# EAGLE design pikado (EAGLE 5.07)
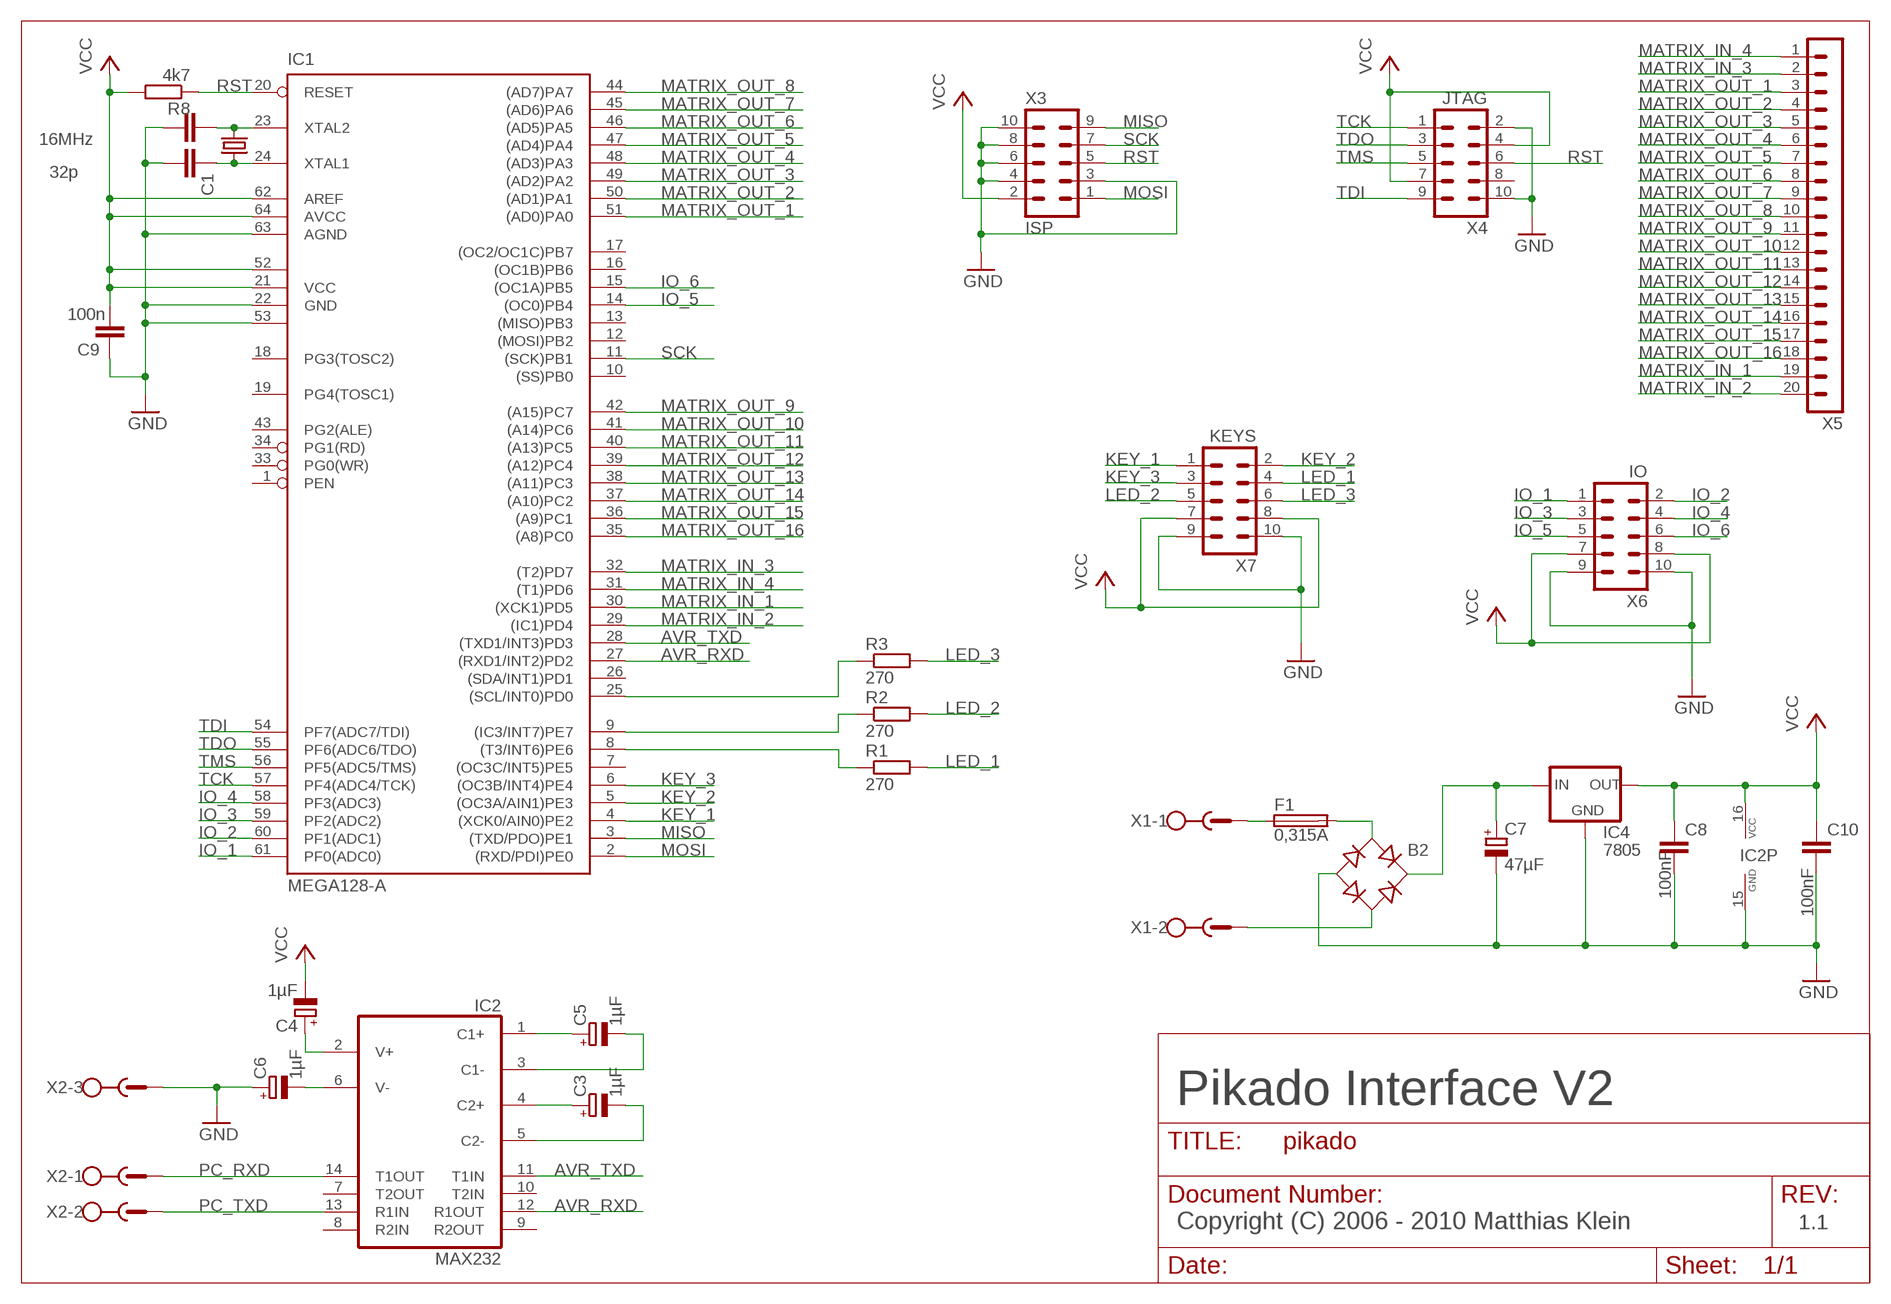
[diagram p0: schematic, sheet 1]

## Parts
B2  RB1A  [RB1A]
C1  32p  C-EU025-025X050  [C025-025X050]
C2  32p  C-EU025-025X050  [C025-025X050]
C3  1µF  CPOL-EUE2.5-5  [E2,5-5]
C4  1µF  CPOL-EUE2.5-5  [E2,5-5]
C5  1µF  CPOL-EUE2.5-5  [E2,5-5]
C6  1µF  CPOL-EUE2.5-5  [E2,5-5]
C7  47µF  CPOL-EUE2-5  [E2-5]
C8  100nF  C-EU025-025X050  [C025-025X050]
C9  100n  C-EU025-025X050  [C025-025X050]
C10  100nF  C-EU025-025X050  [C025-025X050]
F1  0,315A  TR5  [TR5]
IC1  MEGA128-A  [TQFP64]
IC2  MAX232  [DIL16]
IC4  7805  78XXS  [78XXS]
Q1  16MHz  CRYSTALHC49U-V  [HC49U-V]
R1  270  R-EU_0207/10  [0207/10]
R2  270  R-EU_0207/10  [0207/10]
R3  270  R-EU_0207/10  [0207/10]
R8  4k7  R-EU_0207/10  [0207/10]
X1  RIA182-02  [RIA182-02]
X2  RIA182-03  [RIA182-03]
X3  ISP  ML10  [ML10]
X4  JTAG  ML10  [ML10]
X5  MA20-1  [MA20-1]
X6  IO  ML10  [ML10]
X7  KEYS  ML10  [ML10]

## Nets
AVR_RXD: IC1.27((RXD1/INT2)PD2) IC2.12(R1OUT)
AVR_TXD: IC1.28((TXD1/INT3)PD3) IC2.11(T1IN)
GND: B2.- C1.2 C2.2 C6.+ C7.- C8.2 C9.1 C10.2 IC1.22(GND) IC1.53(GND1) IC1.63(AGND) IC2.15(GND) IC4.GND X2.3 X3.3 X3.4 X3.6 X3.8 X3.10 X4.2 X4.10 X6.9 X6.10 X7.9 X7.10
IO_1: IC1.61(PF0(ADC0)) X6.1
IO_2: IC1.60(PF1(ADC1)) X6.2
IO_3: IC1.59(PF2(ADC2)) X6.3
IO_4: IC1.58(PF3(ADC3)) X6.4
IO_5: IC1.14((OC0)PB4) X6.5
IO_6: IC1.15((OC1A)PB5) X6.6
KEY_1: IC1.4((XCK0/AIN0)PE2) X7.1
KEY_2: IC1.5((OC3A/AIN1)PE3) X7.2
KEY_3: IC1.6((OC3B/INT4)PE4) X7.3
LED_1: R1.2 X7.4
LED_2: R2.2 X7.5
LED_3: R3.2 X7.6
MATRIX_IN_1: IC1.30((XCK1)PD5) X5.19
MATRIX_IN_2: IC1.29((IC1)PD4) X5.20
MATRIX_IN_3: IC1.32((T2)PD7) X5.2
MATRIX_IN_4: IC1.31((T1)PD6) X5.1
MATRIX_OUT_1: IC1.51((AD0)PA0) X5.3
MATRIX_OUT_2: IC1.50((AD1)PA1) X5.4
MATRIX_OUT_3: IC1.49((AD2)PA2) X5.5
MATRIX_OUT_4: IC1.48((AD3)PA3) X5.6
MATRIX_OUT_5: IC1.47((AD4)PA4) X5.7
MATRIX_OUT_6: IC1.46((AD5)PA5) X5.8
MATRIX_OUT_7: IC1.45((AD6)PA6) X5.9
MATRIX_OUT_8: IC1.44((AD7)PA7) X5.10
MATRIX_OUT_9: IC1.42((A15)PC7) X5.11
MATRIX_OUT_10: IC1.41((A14)PC6) X5.12
MATRIX_OUT_11: IC1.40((A13)PC5) X5.13
MATRIX_OUT_12: IC1.39((A12)PC4) X5.14
MATRIX_OUT_13: IC1.38((A11)PC3) X5.15
MATRIX_OUT_14: IC1.37((A10)PC2) X5.16
MATRIX_OUT_15: IC1.36((A9)PC1) X5.17
MATRIX_OUT_16: IC1.35((A8)PC0) X5.18
MISO: IC1.3((TXD/PDO)PE1) X3.9
MOSI: IC1.2((RXD/PDI)PE0) X3.1
N$1: C6.- IC2.6(V-)
N$2: B2.+ C7.+ IC4.IN
N$3: C1.1 IC1.24(XTAL1) Q1.1
N$4: IC1.8((T3/INT6)PE6) R1.1
N$5: C2.1 IC1.23(XTAL2) Q1.2
N$7: F1.1 X1.1
N$8: C5.+ IC2.1(C1+)
N$9: C3.+ IC2.4(C2+)
N$10: C5.- IC2.3(C1-)
N$11: C3.- IC2.5(C2-)
N$12: C4.+ IC2.2(V+)
N$13: B2.AC1 F1.2
N$14: IC1.9((IC3/INT7)PE7) R2.1
N$15: IC1.25((SCL/INT0)PD0) R3.1
N$16: B2.AC2 X1.2
PC_RXD: IC2.14(T1OUT) X2.1
PC_TXD: IC2.13(R1IN) X2.2
RST: IC1.20(RESET) R8.1 X3.5 X4.6
SCK: IC1.11((SCK)PB1) X3.7
TCK: IC1.57(PF4(ADC4/TCK)) X4.1
TDI: IC1.54(PF7(ADC7/TDI)) X4.9
TDO: IC1.55(PF6(ADC6/TDO)) X4.3
TMS: IC1.56(PF5(ADC5/TMS)) X4.5
VCC: C4.- C8.1 C9.2 C10.1 IC1.21(VCC) IC1.52(VCC1) IC1.62(AREF) IC1.64(AVCC) IC2.16(VCC) IC4.OUT R8.2 X3.2 X4.4 X4.7 X6.7 X6.8 X7.7 X7.8
Unconnected: IC1.1(PEN) IC1.7((OC3C/INT5)PE5) IC1.10((SS)PB0) IC1.12((MOSI)PB2) IC1.13((MISO)PB3) IC1.16((OC1B)PB6) IC1.17((OC2/OC1C)PB7) IC1.18(PG3(TOSC2)) IC1.19(PG4(TOSC1)) IC1.26((SDA/INT1)PD1) IC1.33(PG0(WR)) IC1.34(PG1(RD)) IC1.43(PG2(ALE)) IC2.7(T2OUT) IC2.8(R2IN) IC2.9(R2OUT) IC2.10(T2IN) X4.8

## Notes on the sheet
- Pikado Interface V2
- Copyright (C) 2006 - 2010 Matthias Klein | 1.1

## Library data of the parts
B2 = rectifier:RB1A: RECTIFIER 1 A
C1 C2 C8-C10 = rcl:C-EU: CAPACITOR, European symbol
C3-C7 = rcl:CPOL-EU: POLARIZED CAPACITOR, European symbol
F1 = fuse:TR5: FUSE Wickmann
IC1 = atmel:MEGA128: MICROCONTROLLER 128 Kbytes FLASH 4 Kbytes SRAM 4 Kbytes EEPROM DUAL USART 8-channel 10 bit ADC Source: avr.lbr
IC2 = maxim:MAX232: RS232 TRANSEIVER
IC4 = v-reg:78XXS: VOLTAGE REGULATOR
Q1 = crystal:CRYSTAL: CRYSTAL
R1-R3 R8 = rcl:R-EU_: RESISTOR, European symbol
X1 = con-ria182:RIA182-02: Gewinkelter Wannenstecker 2-polig Rastermaß: 3,5mm Lötstift / Steckerstift: 1x1mm Bohrung: 1,5mm Bemessungsstrom: 5A Nennquerschnitt Stecker: 1,5qmm eindrähtig / 1qmm feinstdrähtig
X2 = con-ria182:RIA182-03: Gewinkelter Wannenstecker 3-polig Rastermaß: 3,5mm Lötstift / Steckerstift: 1x1mm Bohrung: 1,5mm Bemessungsstrom: 5A Nennquerschnitt Stecker: 1,5qmm eindrähtig / 1qmm feinstdrähtig
X3 X4 X6 X7 = con-harting-ml:ML10: HARTING
X5 = con-lstb:MA20-1: PIN HEADER

## Board
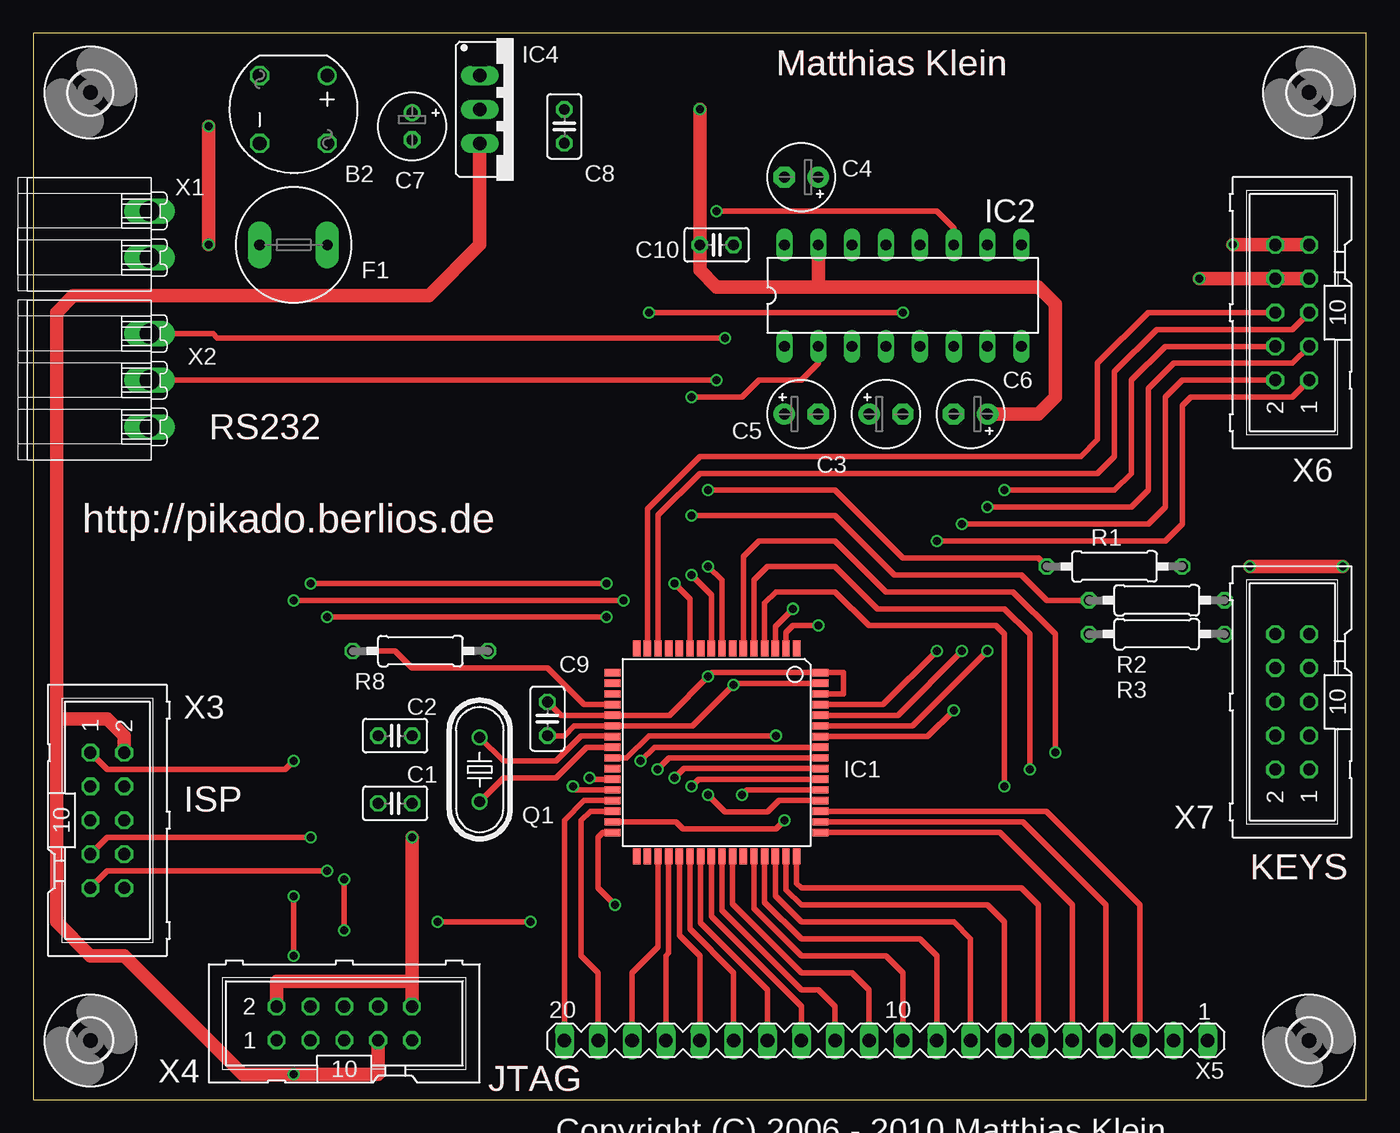
[diagram p1: board, top side]
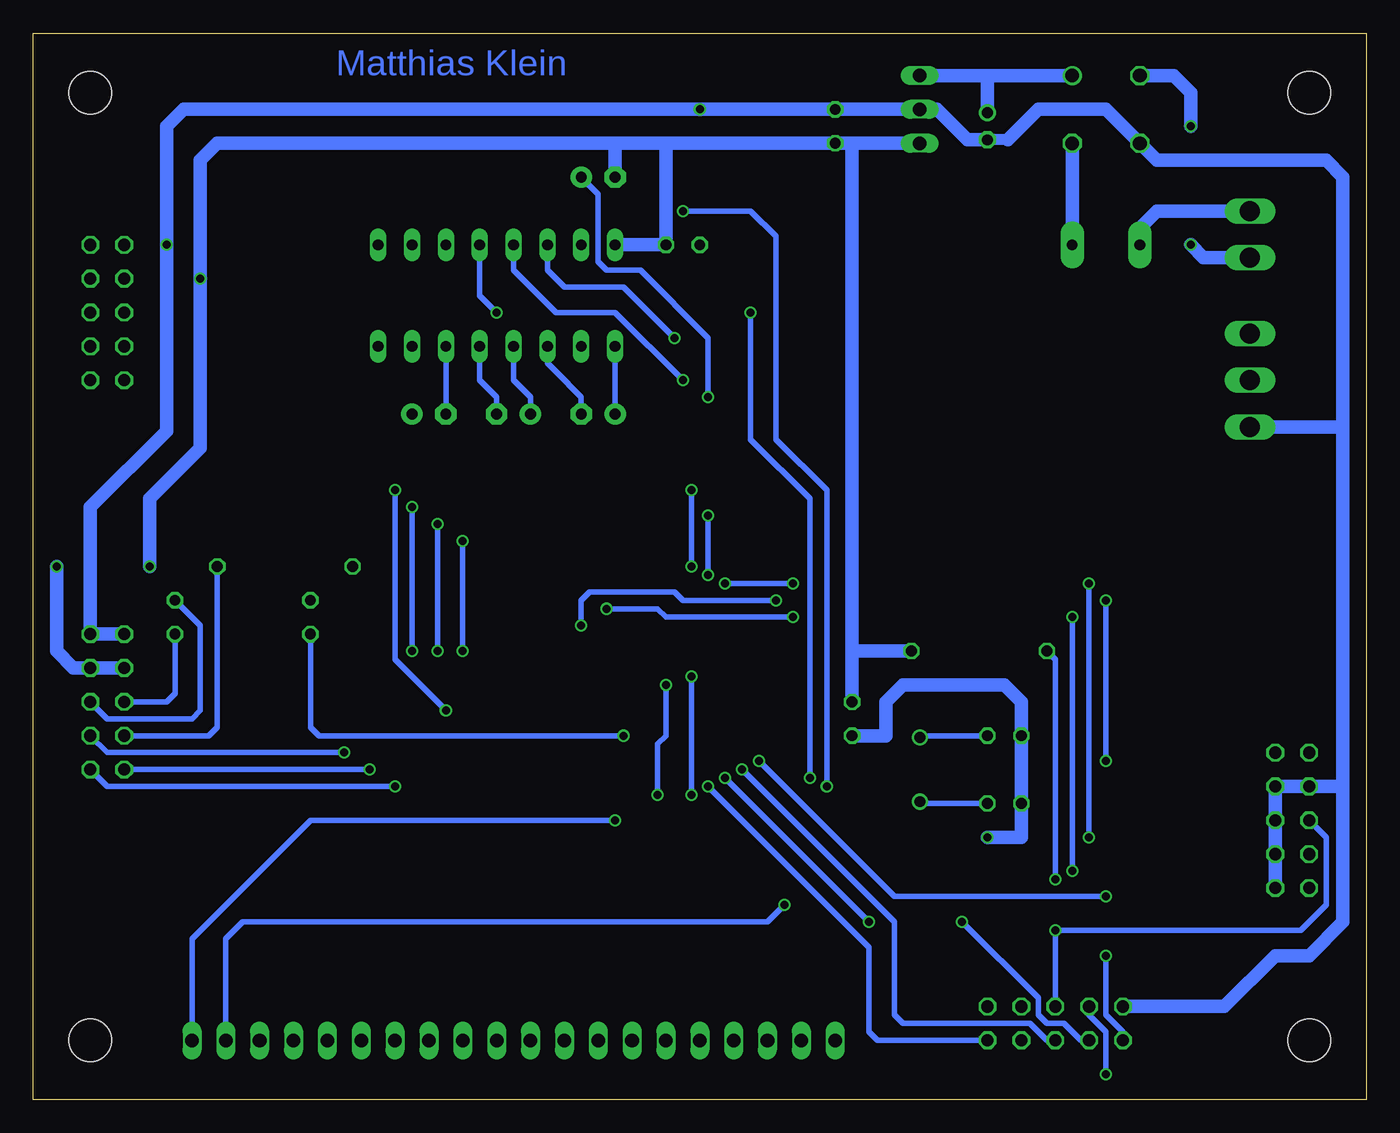
[diagram p2: board, bottom side, seen from below]

Size 100 x 80 mm. Coordinates in mm from the lower left corner, seen from the top.
Outline: 0,0 100,0 100,80 0,80 0,0
Copper layers (1*16): Top 0.035mm / dielectric 1.5mm / Bottom 0.035mm
Design rules "PCB-POOL *": minimum track width 6mil, minimum drill 12mil, track to track 6mil, track to pad 6mil, pad to pad 6mil, via to via 6mil, smd to smd 6mil, copper to edge 20mil, drill to drill 8mil, minimum pad ring 8mil, minimum via ring 6mil, stop-mask expansion 3mil, vias tented up to drill 0mil, thermal gap 8mil

### Footprints (pad centres in the part's own frame; a part is rotated, then mirrored left to right if it is on the bottom)
RB1A = drill 1.016 round: + -2.54,2.54 | drill 1.016 octagon: - 2.54,-2.54; AC1 2.54,2.54; AC2 -2.54,-2.54
C025-025X050 = drill 0.813 octagon: 1 -1.27,0; 2 1.27,0
E2,5-5 = drill 0.813 pad 1.6 round: + -1.27,0 | drill 0.813 pad 1.6 octagon: - 1.27,0
E2-5 = drill 0.813 pad 1.27 round: + -1.016,0 | drill 0.813 pad 1.27 octagon: - 1.016,0
TR5 = drill 0.813 pad 1.778 long: 1 -2.54,0; 2 2.54,0
TQFP64 = smd 1.194 x 0.559: 1 -7.8,6; 2 -7.8,5.2; 3 -7.8,4.4; 4 -7.8,3.6; 5 -7.8,2.8; 6 -7.8,2; 7 -7.8,1.2; 8 -7.8,0.4; 9 -7.8,-0.4; 10 -7.8,-1.2; 11 -7.8,-2; 12 -7.8,-2.8; 13 -7.8,-3.6; 14 -7.8,-4.4; 15 -7.8,-5.2; 16 -7.8,-6; 33 7.8,-6; 34 7.8,-5.2; 35 7.8,-4.4; 36 7.8,-3.6; 37 7.8,-2.8; 38 7.8,-2; 39 7.8,-1.2; 40 7.8,-0.4; 41 7.8,0.4; 42 7.8,1.2; 43 7.8,2; 44 7.8,2.8; 45 7.8,3.6; 46 7.8,4.4; 47 7.8,5.2; 48 7.8,6 | smd 0.559 x 1.194: 17 -6,-7.8; 18 -5.2,-7.8; 19 -4.4,-7.8; 20 -3.6,-7.8; 21 -2.8,-7.8; 22 -2,-7.8; 23 -1.2,-7.8; 24 -0.4,-7.8; 25 0.4,-7.8; 26 1.2,-7.8; 27 2,-7.8; 28 2.8,-7.8; 29 3.6,-7.8; 30 4.4,-7.8; 31 5.2,-7.8; 32 6,-7.8; 49 6,7.8; 50 5.2,7.8; 51 4.4,7.8; 52 3.6,7.8; 53 2.8,7.8; 54 2,7.8; 55 1.2,7.8; 56 0.4,7.8; 57 -0.4,7.8; 58 -1.2,7.8; 59 -2,7.8; 60 -2.8,7.8; 61 -3.6,7.8; 62 -4.4,7.8; 63 -5.2,7.8; 64 -6,7.8
DIL16 = drill 0.813 long: 1 -8.89,-3.81; 2 -6.35,-3.81; 3 -3.81,-3.81; 4 -1.27,-3.81; 5 1.27,-3.81; 6 3.81,-3.81; 7 6.35,-3.81; 8 8.89,-3.81; 9 8.89,3.81; 10 6.35,3.81; 11 3.81,3.81; 12 1.27,3.81; 13 -1.27,3.81; 14 -3.81,3.81; 15 -6.35,3.81; 16 -8.89,3.81
78XXS = drill 1.016 long: GND 0,-2.54; IN -2.54,-2.54; OUT 2.54,-2.54
HC49U-V = drill 0.813 round: 1 -2.413,0; 2 2.413,0
0207/10 = drill 0.813 octagon: 1 -5.08,0; 2 5.08,0
3,2 = hole 3.2: 0,0
RIA182-02 = drill 1.5 long: 1 0,0; 2 3.5,0
RIA182-03 = drill 1.5 long: 1 -3.5,0; 2 0,0; 3 3.5,0
ML10 = drill 0.914 octagon: 1 -5.08,-1.27; 2 -5.08,1.27; 3 -2.54,-1.27; 4 -2.54,1.27; 5 0,-1.27; 6 0,1.27; 7 2.54,-1.27; 8 2.54,1.27; 9 5.08,-1.27; 10 5.08,1.27
MA20-1 = drill 1.016 long: 1 -24.13,0; 2 -21.59,0; 3 -19.05,0; 4 -16.51,0; 5 -13.97,0; 6 -11.43,0; 7 -8.89,0; 8 -6.35,0; 9 -3.81,0; 10 -1.27,0; 11 1.27,0; 12 3.81,0; 13 6.35,0; 14 8.89,0; 15 11.43,0; 16 13.97,0; 17 16.51,0; 18 19.05,0; 19 21.59,0; 20 24.13,0

### Placement (x,y rotation side)
B2  19.52,74.29 270 top
C1  27.14,22.22 180 top
C2  27.14,27.3 180 top
C3  63.97,51.43 0 top
C4  57.62,69.21 180 top
C5  57.62,51.43 0 top
C6  70.32,51.43 180 top
C7  28.41,73.02 270 top
C8  39.84,73.02 90 top
C9  38.57,28.57 90 top
C10  51.27,64.13 180 top
F1  19.52,64.13 0 top
IC1  51.27,26.03 270 top
IC2  65.24,60.32 0 top
IC4  36.03,74.29 270 top
Q1  33.49,24.76 90 top
R1  81.11,40 0 top
R2  84.29,37.46 0 top
R3  84.29,34.92 0 top
R8  29.04,33.65 0 top
U$1  [3,2]  4.28,75.56 0 top
U$2  [3,2]  4.28,4.44 0 top
U$3  [3,2]  95.72,4.44 0 top
U$4  [3,2]  95.72,75.56 0 top
X1  8.73,66.67 270 top
X2  8.73,53.97 270 top
X3  5.55,20.95 270 top
X4  23.33,5.71 0 top
X5  63.97,4.44 180 top
X6  94.45,59.05 90 top
X7  94.45,29.84 90 top

### Tracks (layer width: path | path; a pad name or v marks a point on that pad's centre or on a via)
AVR_RXD  (via drill 0.6)
  Top 0.406: v46.19,59.05 v65.24,59.05 | IC1.27 41.84,24.03 v41.74,24.12
  Bottom 0.406: IC2.12 66.51,60.32 v65.24,59.05 | v41.74,24.12 41.74,45.08 46.19,49.53 v46.19,59.05
AVR_TXD  (via drill 0.6)
  Top 0.406: IC1.28 40.73,23.23 v40.48,23.49 | IC2.11 69.05,65.4 67.78,66.67 v51.27,66.67
  Bottom 0.406: v51.27,66.67 46.19,66.67 44.28,64.77 44.28,49.53 40.48,45.72 v40.48,23.49
GND  (via drill 0.6)
  Top 0.406: C9.1 39.84,27.3 40.57,28.03 IC1.22 49.46,28.03 v52.54,31.11 52.66,31.23 IC1.63 | IC1.53 53.55,23.23 v53.17,22.86
  Top 1.016: v50,74.29 C10.2 50,62.23 51.27,60.96 58.89,60.96 | 58.89,60.96 75.4,60.96 76.67,59.69 76.67,52.7 75.4,51.43 C6.+ | 58.89,60.96 IC2.15 | 28.41,8.89 X4.10 | 28.41,8.89 v28.41,19.68 | X4.2 18.25,8.89 28.41,8.89 | X6.9 X6.10 v90,64.13
  Bottom 0.406: v52.54,31.11 52.54,27.3 53.17,26.66 v53.17,22.86
  Bottom 0.813: 26.89,72 C7.- | 32.22,74.29 IC4.GND
  Bottom 1.016: 26.89,72 24.6,74.29 19.52,74.29 B2.- 15.71,70.48 3.01,70.48 1.74,69.21 1.74,50.16 | C7.- 29.93,72 32.22,74.29 | IC4.GND C8.2 v50,74.29 88.73,74.29 90,73.02 v90,64.13 90,50.16 95.72,44.45 X7.9 X7.10 | 1.74,23.49 1.74,13.33 4.28,10.79 6.82,10.79 10.63,6.98 X4.2 | 1.74,23.49 1.74,50.16 | X2.3 2.05,50.47 1.74,50.16 | 1.74,23.49 X3.3 X3.4 X3.6 X3.8 X3.10 | C9.1 36.03,27.3 36.03,29.84 34.76,31.11 27.14,31.11 25.87,29.84 C1.2 | v28.41,19.68 25.87,19.68 C1.2 | C1.2 C2.2
IO_1  (via drill 0.6)
  Top 0.406: IC1.61 63.76,29.63 v67.78,33.65 | X6.1 94.45,52.7 86.83,52.7 86.19,52.07 86.19,43.18 84.92,41.91 v67.78,41.91
  Bottom 0.406: v67.78,33.65 v67.78,41.91
IO_2  (via drill 0.6)
  Top 0.406: IC1.60 64.86,28.83 v69.69,33.65 | X6.2 86.19,53.97 84.92,52.7 84.92,44.45 83.66,43.18 v69.69,43.18
  Bottom 0.406: v69.69,33.65 v69.69,43.18
IO_3  (via drill 0.6)
  Top 0.406: IC1.59 65.97,28.03 v71.59,33.65 | X6.3 94.45,55.24 85.56,55.24 83.66,53.34 83.66,45.72 82.39,44.45 v71.59,44.45
  Bottom 0.406: v71.59,33.65 v71.59,44.45
IO_4  (via drill 0.6)
  Top 0.406: IC1.58 67.08,27.23 v69.05,29.2 | X6.4 84.92,56.51 82.39,53.97 82.39,46.98 81.11,45.72 v72.86,45.72
  Bottom 0.406: v69.05,29.2 72.86,33.02 v72.86,45.72
IO_5
  Top 0.406: X6.5 94.45,57.78 84.29,57.78 81.11,54.61 81.11,48.26 79.84,46.98 50,46.98 46.87,43.86 IC1.14
IO_6
  Top 0.406: X6.6 83.66,59.05 79.84,55.24 79.84,49.53 78.58,48.26 50,48.26 46.07,44.33 IC1.15
KEY_1  (via drill 0.6)
  Top 0.406: v72.86,23.49 72.86,34.92 72.22,35.55 62.7,35.55 60.16,38.1 55.71,38.1 54.87,37.25 IC1.4
  Bottom 0.406: X7.1 94.45,23.49 v72.86,23.49
KEY_2  (via drill 0.6)
  Top 0.406: v74.77,24.76 74.77,34.92 72.86,36.83 63.34,36.83 60.16,40 55.08,40 54.07,38.99 IC1.5
  Bottom 0.406: v74.77,24.76 X7.2
KEY_3  (via drill 0.6)
  Top 0.406: v76.67,26.03 76.67,34.92 73.5,38.1 63.97,38.1 60.16,41.91 54.45,41.91 53.27,40.73 IC1.6
  Bottom 0.406: X7.3 94.45,26.03 v76.67,26.03
LED_1
  Bottom 0.406: X7.4 86.83,27.3 86.19,27.93 R1.2
LED_2
  Bottom 0.406: X7.5 94.45,28.57 88.1,28.57 87.47,29.2 87.47,35.55 R2.2
LED_3
  Bottom 0.406: X7.6 90,29.84 89.37,30.47 R3.2
MATRIX_IN_1
  Top 0.406: IC1.30 41.79,21.63 41.11,20.95 41.11,10.79 42.38,9.52 X5.19
MATRIX_IN_2
  Top 0.406: IC1.29 41.32,22.43 39.84,20.95 X5.20
MATRIX_IN_3  (via drill 0.6)
  Top 0.406: IC1.32 42.73,20.03 42.38,19.68 42.38,15.87 v43.65,14.6
  Bottom 0.406: v43.65,14.6 44.92,13.33 84.29,13.33 85.56,12.06 X5.2
MATRIX_IN_4  (via drill 0.6)
  Top 0.406: IC1.31 48.21,20.83 48.73,20.31 55.71,20.31 v56.35,20.95
  Bottom 0.406: v56.35,20.95 79.21,20.95 88.1,12.06 X5.1
MATRIX_OUT_1
  Top 0.406: IC1.51 75.99,21.63 83.02,14.6 X5.3
MATRIX_OUT_2
  Top 0.406: IC1.50 74.25,20.83 80.48,14.6 X5.4
MATRIX_OUT_3
  Top 0.406: IC1.49 72.51,20.03 77.94,14.6 X5.5
MATRIX_OUT_4
  Top 0.406: IC1.48 57.27,16.22 57.62,15.87 74.13,15.87 75.4,14.6 X5.6
MATRIX_OUT_5
  Top 0.406: IC1.47 56.47,15.75 57.62,14.6 71.59,14.6 72.86,13.33 X5.7
MATRIX_OUT_6
  Top 0.406: IC1.46 55.67,15.28 57.62,13.33 69.05,13.33 70.32,12.06 X5.8
MATRIX_OUT_7
  Top 0.406: IC1.45 54.87,14.81 57.62,12.06 66.51,12.06 67.78,10.79 X5.9
MATRIX_OUT_8
  Top 0.406: IC1.44 54.07,14.34 57.62,10.79 63.97,10.79 65.24,9.52 X5.10
MATRIX_OUT_9
  Top 0.406: IC1.42 52.47,14.67 57.62,9.52 61.43,9.52 62.7,8.25 X5.11
MATRIX_OUT_10
  Top 0.406: IC1.41 51.67,14.2 57.62,8.25 58.89,8.25 60.16,6.98 X5.12
MATRIX_OUT_11
  Top 0.406: IC1.40 50.87,13.73 57.62,6.98 X5.13
MATRIX_OUT_12
  Top 0.406: IC1.39 50.07,13.26 55.08,8.25 X5.14
MATRIX_OUT_13
  Top 0.406: IC1.38 49.27,12.79 52.54,9.52 X5.15
MATRIX_OUT_14
  Top 0.406: IC1.37 48.47,12.32 50,10.79 X5.16
MATRIX_OUT_15
  Top 0.406: IC1.36 47.67,11 47.46,10.79 X5.17
MATRIX_OUT_16
  Top 0.406: IC1.35 46.87,11.47 44.92,9.52 X5.18
MISO  (via drill 0.6)
  Top 0.406: X3.9 5.55,17.14 v22.06,17.14 | v22.06,36.19 v43.02,36.19 | IC1.3 55.67,35.51 v56.98,36.83
  Bottom 0.406: v22.06,17.14 v22.06,36.19 | v43.02,36.19 52.54,36.19 53.17,36.83 v56.98,36.83
MOSI  (via drill 0.6)
  Top 0.406: v19.52,37.46 v44.28,37.46 | v19.52,25.39 18.88,24.76 5.55,24.76 X3.1 | IC1.2 56.47,35.04 56.98,35.55 v58.89,35.55
  Bottom 0.406: v19.52,25.39 v19.52,37.46 | v44.28,37.46 51.27,37.46 51.91,38.1 58.25,38.1 58.89,37.46 v58.89,35.55
N$1
  Bottom 0.406: C6.- IC2.6
N$2
  Bottom 1.016: B2.+ 28.41,76.83 | 28.41,76.83 IC4.IN | 28.41,76.83 C7.+
N$3
  Top 0.406: IC1.24 41.51,26.43 39.2,24.12 35.27,24.12 Q1.1
  Bottom 0.406: 33.62,22.35 Q1.1 33.36,22.22 C1.1
N$4  (via drill 0.6)
  Top 0.406: R1.1 75.4,40.64 65.24,40.64 60.16,45.72 v50.63,45.72 | IC1.8 51.67,38.97 v50.63,40
  Bottom 0.406: v50.63,40 v50.63,45.72
N$5
  Top 0.406: IC1.23 43.4,27.3 41.11,27.3 39.2,25.39 35.27,25.39 Q1.2
  Bottom 0.406: C2.1 33.36,27.3 Q1.2
N$7
  Bottom 1.016: F1.1 16.98,65.4 15.71,66.67 X1.1
N$8
  Bottom 0.406: C5.+ IC2.1
N$9
  Bottom 0.406: IC2.4 63.97,53.97 62.7,52.7 C3.+
N$10
  Bottom 0.406: IC2.3 61.43,55.24 60.8,54.61 58.89,52.7 C5.-
N$11
  Bottom 0.406: IC2.5 66.51,53.97 65.24,52.7 C3.-
N$12  (via drill 0.6)
  Top 0.406: v49.37,52.7 53.17,52.7 54.45,53.97 57.62,53.97 58.89,55.24 IC2.2
  Bottom 0.406: C4.+ 57.62,67.94 57.62,62.86 56.98,62.23 54.45,62.23 49.37,57.15 v49.37,52.7
N$13
  Bottom 1.016: F1.2 B2.AC1
N$14  (via drill 0.6)
  Top 0.406: IC1.9 50.87,37.86 v49.37,39.37 | R2.1 76.03,37.46 74.13,39.37 64.61,39.37 60.16,43.81 v49.37,43.81
  Bottom 0.406: v49.37,39.37 v49.37,43.81
N$15  (via drill 0.6)
  Top 0.406: IC1.25 44.52,25.63 46.19,27.3 v55.71,27.3
  Bottom 0.406: v55.71,27.3 78.58,27.3 79.21,27.93 R3.1
N$16  (via drill 0.6)
  Top 1.016: v13.17,64.13 v13.17,73.02
  Bottom 1.016: X1.2 12.21,63.17 v13.17,64.13 | v13.17,73.02 13.17,75.56 14.44,76.83 B2.AC2
PC_RXD  (via drill 0.6)
  Top 0.406: v51.91,57.15 13.81,57.15 13.48,57.47 X2.1
  Bottom 0.406: IC2.14 61.43,62.23 60.16,60.96 55.71,60.96 v51.91,57.15
PC_TXD  (via drill 0.6)
  Top 0.406: X2.2 v51.27,53.97
  Bottom 0.406: IC2.13 63.97,62.23 60.8,59.05 56.35,59.05 v51.27,53.97
RST  (via drill 0.6)
  Top 0.406: IC1.20 41.32,29.63 38.57,32.38 28.41,32.38 27.14,33.65 R8.1 | v23.33,12.7 v23.33,16.5
  Bottom 0.406: X3.5 3.01,19.68 3.01,14.6 4.92,12.7 v23.33,12.7 X4.6 | R8.1 23.33,33.02 v23.33,16.5
SCK  (via drill 0.6)
  Top 0.406: X3.7 5.55,19.68 v20.79,19.68 | IC1.11 49.27,37.55 v48.09,38.73 | v20.79,38.73 v43.02,38.73
  Bottom 0.406: v43.02,38.73 v48.09,38.73 | v20.79,19.68 v20.79,38.73
TCK  (via drill 0.6)
  Top 0.406: IC1.57 46.59,26.43 v45.55,25.39 | v19.52,10.79 v19.52,15.24
  Bottom 0.406: X4.1 18.25,5.08 19.52,6.34 v19.52,10.79 | v19.52,15.24 35.39,15.24 v45.55,25.39
TDI  (via drill 0.6)
  Top 0.406: IC1.54 49.91,24.03 v49.37,23.49
  Bottom 0.406: X4.9 36.66,4.44 37.3,5.08 37.3,11.43 v49.37,23.49
TDO  (via drill 0.6)
  Top 0.406: IC1.55 48.8,24.83 v48.09,24.12 | v30.31,13.33 v37.3,13.33
  Bottom 0.406: X4.3 21.42,4.44 22.7,5.71 23.96,5.71 24.6,6.34 24.6,7.62 v30.31,13.33 | v37.3,13.33 v48.09,24.12
TMS  (via drill 0.6)
  Top 0.406: IC1.56 47.7,25.63 v46.82,24.76
  Bottom 0.406: X4.5 23.96,4.44 25.23,5.71 34.76,5.71 35.39,6.34 35.39,13.33 v46.82,24.76
VCC  (via drill 0.6)
  Top 0.406: v50.63,22.86 51.91,21.58 55.08,21.58 55.92,22.43 IC1.52 | C9.2 39.58,28.83 IC1.21 47.72,28.83 v50.63,31.74 50.92,32.03 IC1.64 60.8,32.03 60.8,30.43 IC1.62
  Top 1.016: v91.28,40 v98.26,40 | 1.74,28.57 1.74,13.33 4.28,10.79 6.82,10.79 15.71,1.9 v19.52,1.9 25.87,1.9 X4.7 | X3.2 6.82,27.3 5.55,28.57 1.74,28.57 | 1.74,28.57 1.74,59.05 3.01,60.32 29.68,60.32 33.49,64.13 IC4.OUT | X6.7 X6.8 v87.47,61.59
  Bottom 0.406: v50.63,31.74 v50.63,22.86 | X4.4 20.79,6.34 19.52,5.08 v19.52,1.9
  Bottom 1.016: IC4.OUT 38.57,71.75 | 38.57,71.75 C8.1 52.54,71.75 | 52.54,71.75 56.35,71.75 | v91.28,40 91.28,45.08 87.47,48.89 v87.47,61.59 87.47,70.48 86.19,71.75 56.35,71.75 | v98.26,40 98.26,33.65 96.99,32.38 X7.7 X7.8 | 52.54,71.75 C10.1 IC2.16 | 56.35,71.75 C4.- | 38.57,33.65 C9.2 | 38.57,33.65 R8.2 | 38.57,71.75 38.57,33.65

### Text on the board
Top: Matthias Klein | RS232 | http://pikado.berlios.de | ISP | KEYS | JTAG
Bottom: Matthias Klein
tNames: Matthias Klein | RS232 | http://pikado.berlios.de | ISP | KEYS | JTAG | Copyright (C) 2006 - 2010 Matthias Klein